# EAGLE design E-fliteMultiBatteryCharger (EAGLE 5.06)
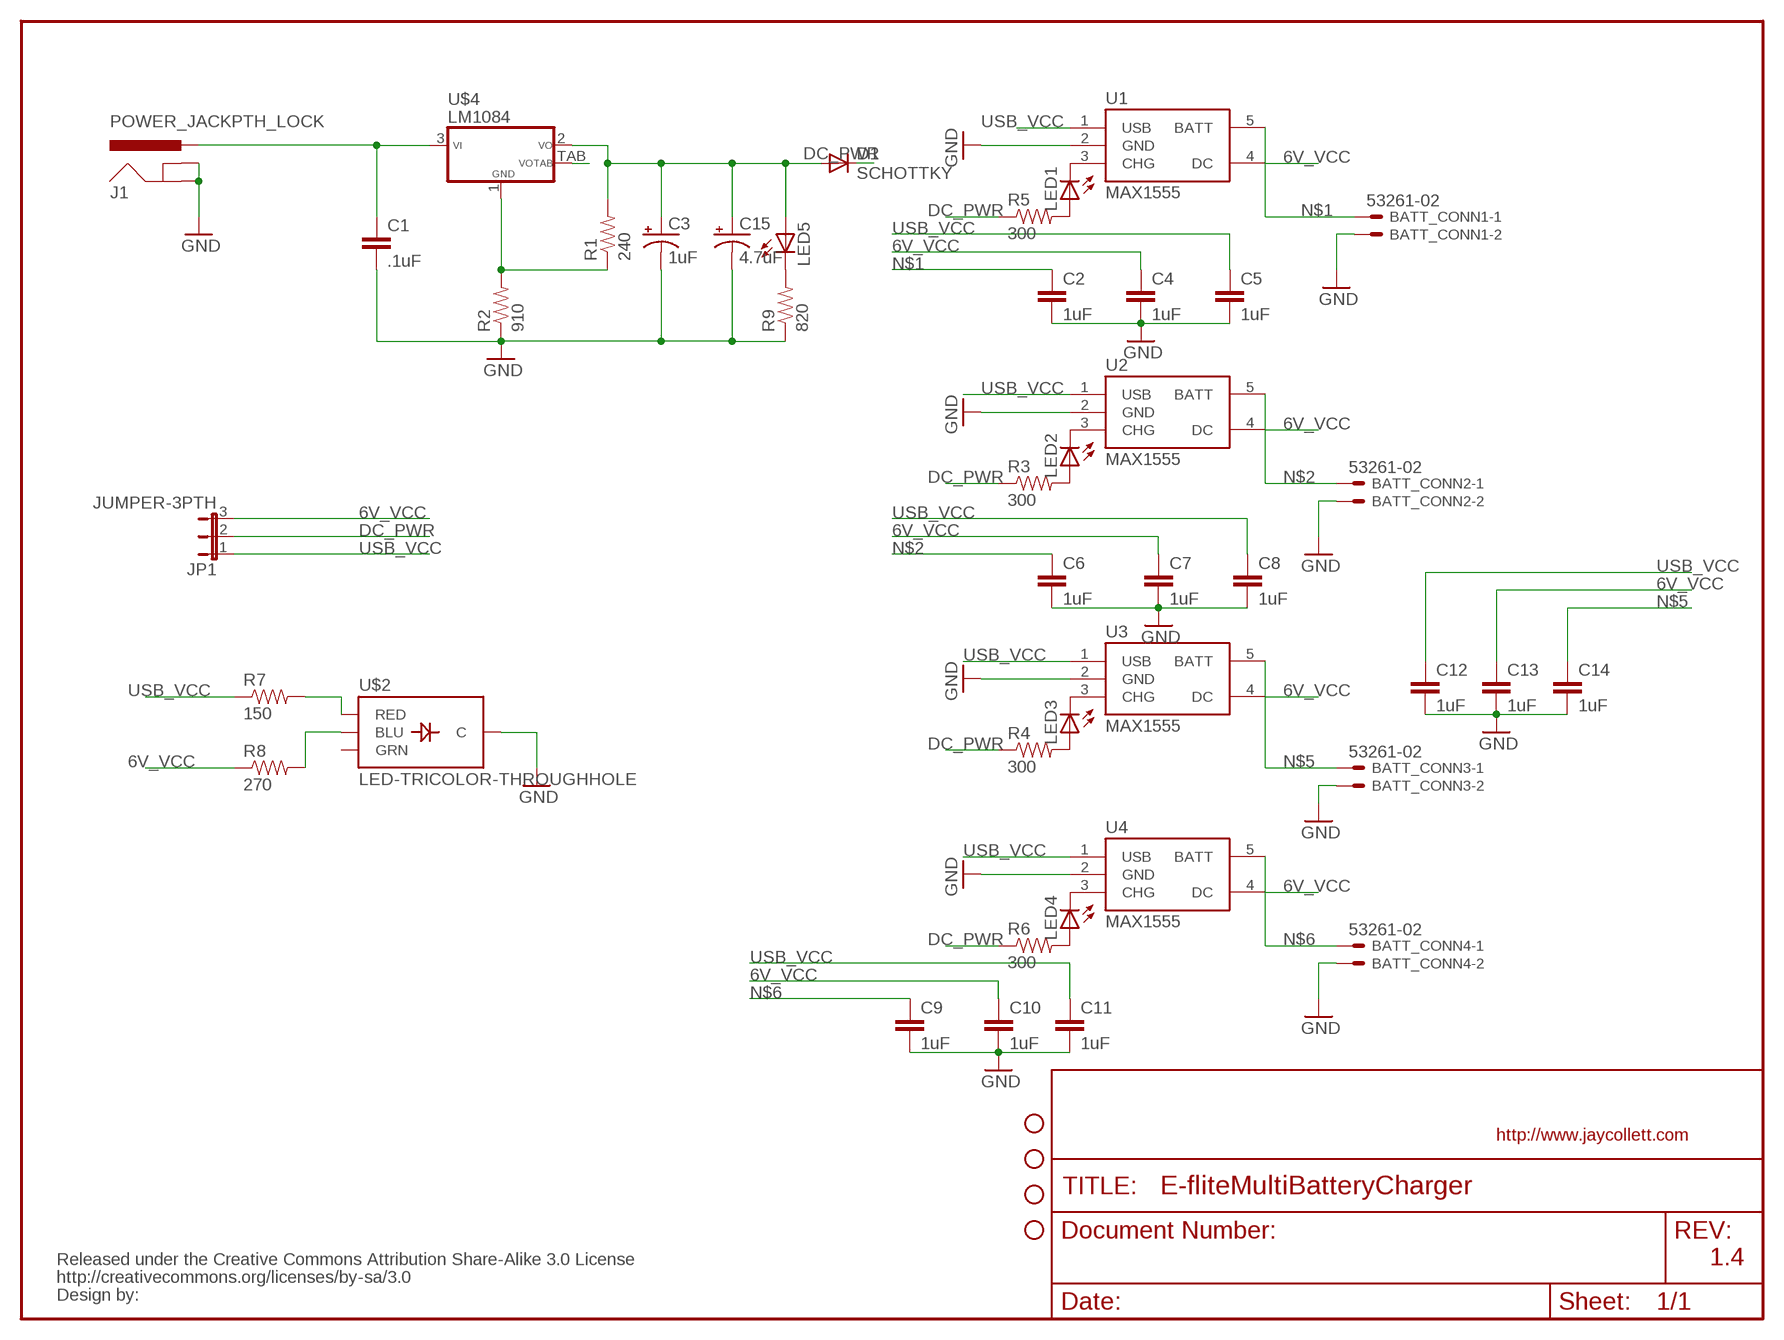
[diagram p0: schematic, sheet 1]

## Parts
BATT_CONN1  53261-02  [53261-02]
BATT_CONN2  53261-02  [53261-02]
BATT_CONN3  53261-02  [53261-02]
BATT_CONN4  53261-02  [53261-02]
C1  .1uF  CAP0603-CAP  [0603-CAP]
C2  1uF  CAP0603-CAP  [0603-CAP]
C3  1uF  CAP_POL1206  [EIA3216]
C4  1uF  CAP0603-CAP  [0603-CAP]
C5  1uF  CAP0603-CAP  [0603-CAP]
C6  1uF  CAP0603-CAP  [0603-CAP]
C7  1uF  CAP0603-CAP  [0603-CAP]
C8  1uF  CAP0603-CAP  [0603-CAP]
C9  1uF  CAP0603-CAP  [0603-CAP]
C10  1uF  CAP0603-CAP  [0603-CAP]
C11  1uF  CAP0603-CAP  [0603-CAP]
C12  1uF  CAP0603-CAP  [0603-CAP]
C13  1uF  CAP0603-CAP  [0603-CAP]
C14  1uF  CAP0603-CAP  [0603-CAP]
C15  4.7uF  CAP_POL1206  [EIA3216]
D1  SCHOTTKY  DIODESMA  [SMA-DIODE]
J1  POWER_JACKPTH_LOCK  [POWER_JACK_PTH_LOCK]
JP1  JUMPER-3PTH  [1X03]
JP2  STAND-OFF  [STAND-OFF]
JP3  STAND-OFF  [STAND-OFF]
JP4  STAND-OFF  [STAND-OFF]
JP5  STAND-OFF  [STAND-OFF]
LED1  LED3MM  [LED3MM]
LED2  LED3MM  [LED3MM]
LED3  LED3MM  [LED3MM]
LED4  LED3MM  [LED3MM]
LED5  LED0603  [LED-0603]
R1  240  RESISTOR1206  [1206]
R2  910  RESISTOR1206  [1206]
R3  300  RESISTOR  [0805]
R4  300  RESISTOR  [0805]
R5  300  RESISTOR  [0805]
R6  300  RESISTOR  [0805]
R7  150  RESISTOR  [0805]
R8  270  RESISTOR  [0805]
R9  820  RESISTOR  [0805]
U1  MAX1555  [SOT23-5]
U2  MAX1555  [SOT23-5]
U3  MAX1555  [SOT23-5]
U4  MAX1555  [SOT23-5]
U$1  CREATIVE_COMMONS  [CREATIVE_COMMONS]
U$2  LED-TRICOLOR-THROUGHHOLE  [LED-TRICOLOR-THROUGHHOLE]
U$4  LM1084  [TO263-3]

## Nets
6V_VCC: C4.1 C7.1 C10.1 C13.1 JP1.3 R8.1 U1.4(DC) U2.4(DC) U3.4(DC) U4.4(DC)
DC_PWR: D1.C JP1.2 R3.1 R4.1 R5.1 R6.1
GND: BATT_CONN1.2 BATT_CONN2.2 BATT_CONN3.2 BATT_CONN4.2 C1.2 C2.2 C3.C(-) C4.2 C5.2 C6.2 C7.2 C8.2 C9.2 C10.2 C11.2 C12.2 C13.2 C14.2 C15.C(-) J1.GND J1.GNDBREAK R2.1 R9.1 U1.2(GND) U2.2(GND) U3.2(GND) U4.2(GND) U$2.GND(C)
N$1: BATT_CONN1.1 C2.1 U1.5(BATT)
N$2: BATT_CONN2.1 C6.1 U2.5(BATT)
N$3: C1.1 J1.PWR U$4.3(VI)
N$4: R1.1 R2.2 U$4.1(GND)
N$5: BATT_CONN3.1 C14.1 U3.5(BATT)
N$6: BATT_CONN4.1 C9.1 U4.5(BATT)
N$8: LED1.K(C) U1.3(CHG)
N$9: LED1.A R5.2
N$10: LED2.K(C) U2.3(CHG)
N$11: LED2.A R3.2
N$12: LED3.K(C) U3.3(CHG)
N$13: LED3.A R4.2
N$14: LED4.K(C) U4.3(CHG)
N$15: LED4.A R6.2
N$16: R7.2 U$2.RED
N$17: R8.2 U$2.BLU
N$18: LED5.C R9.2
USB_VCC: C5.1 C8.1 C11.1 C12.1 JP1.1 R7.1 U1.1(USB) U2.1(USB) U3.1(USB) U4.1(USB)
VOTAB: C3.A(+) C15.A(+) D1.A LED5.A R1.2 U$4.2(VO) U$4.TAB(VOTAB)
Unconnected: U$2.GRN

## Notes on the sheet
- http://www.jaycollett.com
- 1.4

## Library data of the parts
BATT_CONN1-BATT_CONN4 = con-molex:53?-02: CONNECTOR wire to board 1.25 mm (.049 inch) pitch header
C1 C2 C4-C14 = SparkFun:CAP: Capacitor Standard 0603 ceramic capacitor, and 0.1" leaded capacitor.
C3 C15 = SparkFun:CAP_POL: Capacitor Polarized These are standard SMD and PTH capacitors. Normally 10uF, 47uF, and 100uF in electrolytic and tantalum varieties. Always verify the external diameter of the through hole cap, it varies with capacity, voltage, and manufacturer. The EIA devices should be standard.
D1 = SparkFun:DIODE: Diode These are standard reverse protection diodes and small signal diodes. SMA package can handle up to about 1A. SOD-323 can handle about 200mA. What the SOD-323 package when ordering, there are some mfgs out there that are 5-pin packages.
J1 = SparkFun:POWER_JACK: Power Jack This is the standard 5.5mm barrel jack for power. The PTH is the most common, proven, reliable, footprint. All others are experimental. The Slot footprint only works if the mill layer is transmitted to the PCB fab house so be warned. Spark Fun Electronics SKU : PRT-00119. Mating wall wart : TOL-00298 (and others)
JP1 = SparkFun:JUMPER-3
JP2-JP5 = SparkFun:STAND-OFF: Stand Off This is the mechanical footprint for a #4 phillips button head screw. Use the keepout ring to avoid running the screw head into surrounding components. SKU : PRT-00447
LED1-LED5 = SparkFun:LED: LEDs Standard schematic elements and footprints for 5mm, 3mm, 1206, and 0603 sized LEDs. 5mm - Spark Fun Electronics SKU : COM-00529 (and others)
R1-R9 = SparkFun:RESISTOR: Resistor Basic schematic elements and footprints for 0603, 1206, and PTH 1/10th watt (small) resistors.
U1-U4 = SparkFun:MAX1555: MAX1555 Lithium Charger IC SOT-23 Lithium Polymer charging IC. Schematic element and footprint proven. Spark Fun Electronics SKU : COM-00674
U$1 = SparkFun:CREATIVE_COMMONS
U$2 = SparkFun:LED-TRICOLOR-THROUGHHOLE
U$4 = JayCollett:LM1084: National LM1084 TO-263-3

## Board
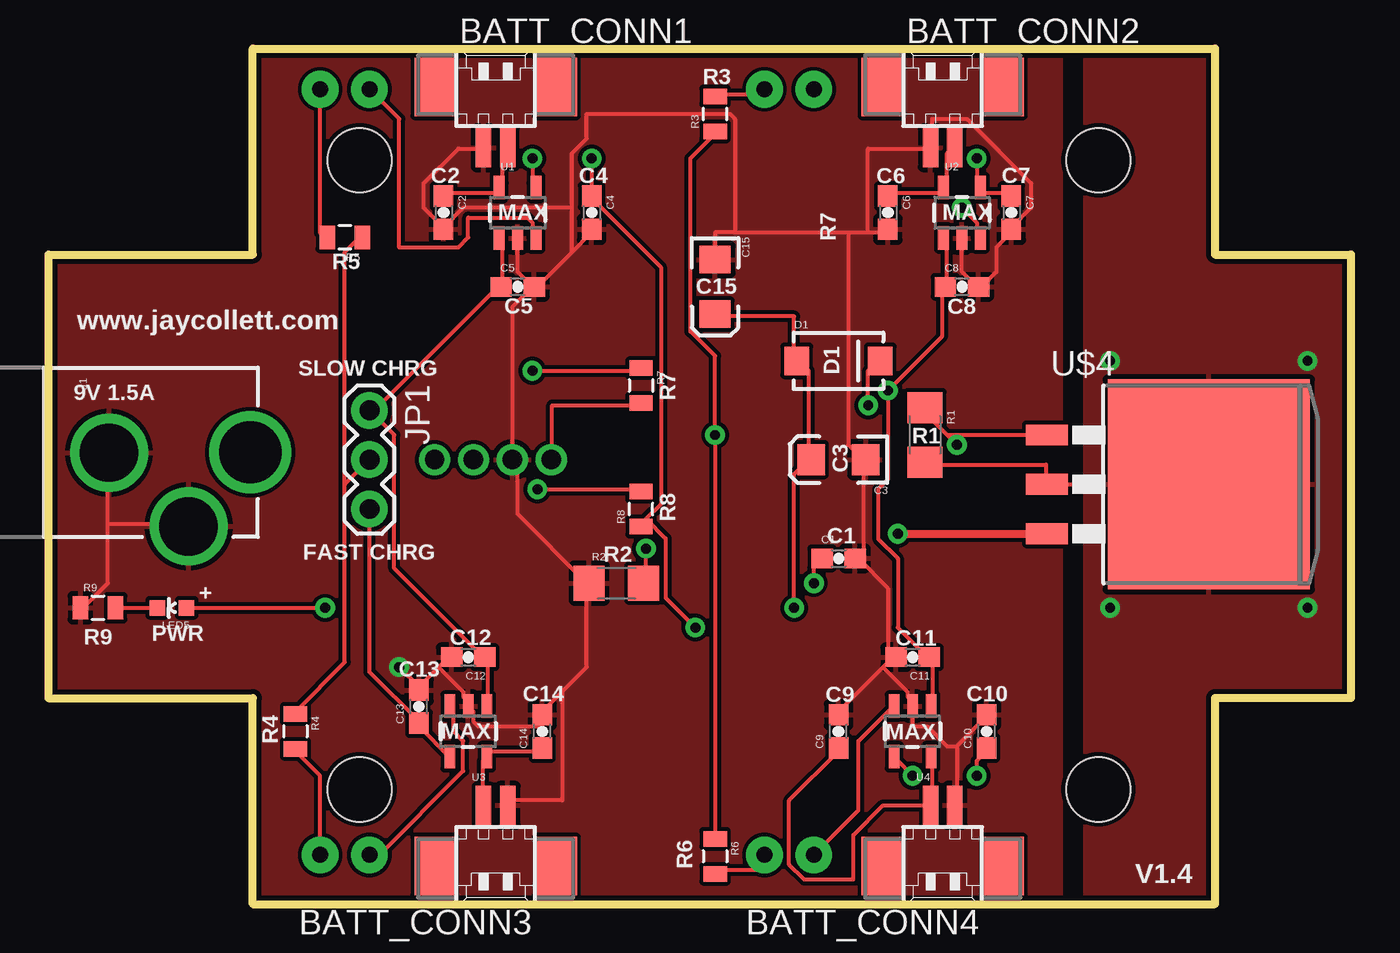
[diagram p1: board, top side]
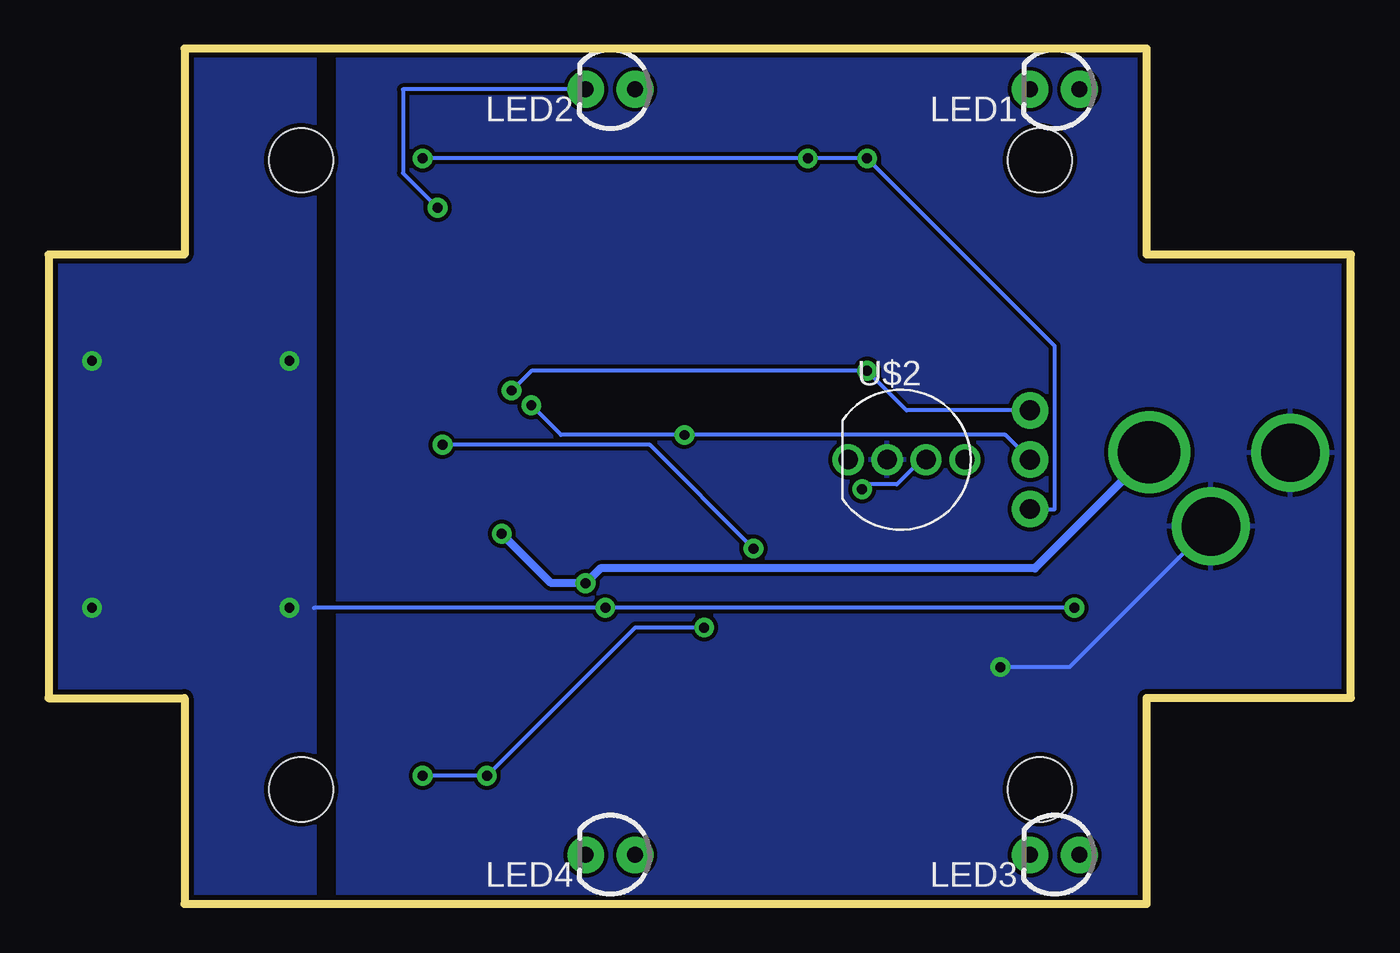
[diagram p2: board, bottom side, seen from below]

Size 67 x 44 mm. Coordinates in mm from the lower left corner, seen from the top.
Outline: 0,10.6 0,33.4 10.5,33.4 10.5,44 60,44 60,33.4 67,33.4 67,10.6 60,10.6 60,0 10.5,0 10.5,10.6 0,10.6
Copper layers (1*16): Top 0.035mm / dielectric 1.5mm / Bottom 0.035mm
Design rules "SparkFun": minimum track width 8mil, minimum drill 20mil, track to track 8mil, track to pad 8mil, pad to pad 8mil, via to via 8mil, smd to smd 8mil, copper to edge 10mil, drill to drill 8mil, minimum pad ring 12mil, minimum via ring 10mil, stop-mask expansion 4mil, vias tented up to drill 25mil, thermal gap 10mil

### Footprints (pad centres in the part's own frame; a part is rotated, then mirrored left to right if it is on the bottom)
53261-02 = smd 0.8 x 2: 1 0.625,-2.5; 2 -0.625,-2.5 | smd 2.1 x 3: S1 3.125,0.625; S2 -3.125,0.625
0603-CAP = smd 1.1 x 1: 1 -0.85,0; 2 0.85,0
EIA3216 = smd 1.4 x 1.6: A 1.4,0; C -1.4,0
SMA-DIODE = smd 1.27 x 1.47: A -2.15,0; C 2.15,0
POWER_JACK_PTH_LOCK = drill 2.997 round: GND 0.025,6.608; GNDBREAK 3.812,10.7 | drill 3.2 round: PWR 0,13.878
1X03 = drill 1.016 pad 1.88 round: 1 0,0; 2 2.54,0; 3 5.08,0
STAND-OFF = hole 3.302: 0,0
LED3MM = drill 0.813 pad 1.88 round: A -1.27,0; K 1.27,0
LED-0603 = smd 0.8 x 0.8: A 0,-0.75; C 0,0.75
1206 = smd 1.6 x 1.8: 1 -1.4,0; 2 1.4,0
0805 = smd 0.8 x 1.2: 1 -0.9,0; 2 0.9,0
SOT23-5 = smd 0.55 x 1.2: 1 -0.95,-1.3; 2 0,-1.3; 3 0.95,-1.3; 4 0.95,1.3; 5 -0.95,1.3
LED-TRICOLOR-THROUGHHOLE = drill 1 round: BLU 1,0; GND -1,0; GRN 3,0; RED -3,0
TO263-3 = smd 1.067 x 2.159: 1 -2.54,-5.791; 2 0,-5.791; 3 2.54,-5.791 | smd 10.8 x 10.41: TAB 0,2.54

### Placement (x,y rotation side)
BATT_CONN1  23,41.4 0 top
BATT_CONN2  46,41.4 0 top
BATT_CONN3  23,2.58 180 top
BATT_CONN4  46,2.58 180 top
C1  40.64,17.78 0 top
C2  20.32,35.56 270 top
C3  40.64,22.86 180 top
C4  27.94,35.56 270 top
C5  24.13,31.75 0 top
C6  43.18,35.56 270 top
C7  49.53,35.56 270 top
C8  46.99,31.75 0 top
C9  40.64,8.89 90 top
C10  48.26,8.89 90 top
C11  44.45,12.7 180 top
C12  21.59,12.7 180 top
C13  19.05,10.16 90 top
C14  25.4,8.89 90 top
C15  34.29,31.75 270 top
D1  40.64,27.94 0 top
J1  -3.5,23.24 270 top
JP1  16.51,25.4 270 top
JP2  16,38.25 0 top
JP3  16,5.9 0 top
JP4  54,5.9 0 top
JP5  54,38.25 0 top
LED1  15.24,41.91 180 bottom
LED2  38.1,41.91 180 bottom
LED3  15.24,2.54 180 bottom
LED4  38.1,2.54 180 bottom
LED5  6.35,15.24 90 top
R1  45.09,24.13 270 top
R2  29.21,16.51 0 top
R3  34.29,40.64 90 top
R4  12.7,8.89 270 top
R5  15.24,34.29 180 top
R6  34.29,2.46 270 top
R7  30.48,26.67 270 top
R8  30.48,20.32 90 top
R9  2.54,15.24 0 top
U1  24.13,35.56 0 top
U2  46.99,35.56 0 top
U3  21.59,8.89 180 top
U4  44.45,8.89 180 top
U$1  2.54,29.21 0 top
U$2  22.86,22.86 0 bottom
U$4  57.15,21.59 270 top

### Tracks (layer width: path | path; a pad name or v marks a point on that pad's centre or on a via)
6V_VCC  (via drill 0.51)
  Top 0.203: v47.75,6.6 47.75,7.37 48.26,7.87 C10.1 | v44.45,6.6 43.69,7.37 U4.4 | 30.73,19.81 30.48,19.56 R8.1 30.73,19.81 | 30.73,19.81 31.5,20.57 31.5,32.77 27.94,36.32 C4.1 v27.94,38.35 | v33.27,14.22 31.75,15.75 31.75,18.8 30.73,19.81 | U3.4 20.57,7.62 19.05,9.14 C13.1 19.05,9.4 16.51,11.94 JP1.3 | C7.1 49.53,36.58 48.01,36.58 48.01,36.83 U2.4 47.75,37.08 v47.75,38.35 | v24.89,38.35 24.89,37.08 U1.4
  Bottom 0.203: v47.75,6.6 v44.45,6.6 36.83,14.22 v33.27,14.22 | JP1.3 15.24,20.32 15.24,28.7 v24.89,38.35 v27.94,38.35 v47.75,38.35
DC_PWR  (via drill 0.51)
  Top 0.203: R6.1 v34.29,24.13 34.29,28.19 33.02,29.46 33.02,38.35 34.29,39.62 R3.1 | 15.24,21.59 15.24,12.45 12.7,9.91 R4.1 | 15.24,21.59 JP1.2 | 15.24,21.59 15.24,33.53 16,34.29 R5.1 | v42.16,25.65 42.16,27.43 42.67,27.94 D1.C
  Bottom 0.203: v42.16,25.65 40.64,24.13 v34.29,24.13 17.78,24.13 JP1.2
GND  (via drill 0.51)
  Top 0.203: U2.2 46.99,32.51 47.75,31.75 C8.2 48.01,31.75 48.77,32.51 48.77,33.78 49.53,34.54 C7.2 49.53,34.8 50.55,35.81 50.55,37.08 47.24,40.39 45.47,40.39 45.47,39.12 BATT_CONN2.2 45.21,38.86 42.16,38.86 42.16,34.54 | 35.31,34.54 34.29,34.54 C15.C | 35.31,34.54 41.15,34.54 | 41.15,34.54 42.16,34.54 | 42.16,34.54 43.18,34.54 C6.2 | 46.74,8.13 48.26,9.65 C10.2 | 46.74,8.13 46.74,5.33 BATT_CONN4.2 | 41.66,17.78 41.91,18.03 41.91,22.86 | 43.18,12.45 43.43,12.7 C11.2 43.18,12.45 | 43.18,12.45 42.93,12.19 | 42.93,12.19 40.64,9.91 C9.2 | 42.93,12.19 44.2,10.92 44.2,10.67 44.45,10.41 U4.2 44.45,9.14 45.21,9.14 46.23,8.13 46.74,8.13 | 41.66,17.78 43.18,16.26 43.18,12.45 | 41.66,17.78 C1.2 | 41.15,34.54 41.15,23.62 41.91,22.86 | 41.91,22.86 C3.C | 3.05,19.56 3.05,23.11 J1.GND | 3.05,19.56 3.05,16.51 1.78,15.24 R9.1 | 3.05,19.56 7.11,19.56 J1.GNDBREAK | 20.32,34.8 19.3,35.81 19.3,37.08 21.08,38.86 22.35,38.86 BATT_CONN1.2 | 24.89,31.75 24.13,32.51 U1.2 | 26.92,33.53 25.15,31.75 C5.2 24.89,31.75 | 26.92,33.53 27.94,34.54 C4.2 | 20.07,12.19 20.57,12.7 C12.2 | 19.05,11.18 20.07,12.19 | 20.07,12.19 21.34,10.92 21.34,10.67 21.59,10.41 U3.2 21.59,10.16 21.84,9.91 21.84,9.4 22.1,9.14 25.4,9.14 C14.2 25.4,9.91 26.42,10.92 | 26.42,10.92 27.69,12.19 27.69,16.51 | 26.42,10.92 26.42,5.33 23.88,5.33 BATT_CONN3.2 | 23.88,22.86 24.13,22.61 24.13,20.07 27.69,16.51 | 27.69,16.51 R2.1 | 24.89,31.75 23.88,30.73 23.88,22.86 | 23.88,22.86 U$2.GND | 20.32,34.8 21.34,35.81 26.92,35.81 | 26.92,33.53 26.92,35.81 | 20.32,34.8 C2.2 | v18.03,12.19 19.05,11.18 | 19.05,11.18 C13.2 | 35.31,34.54 35.31,40.39 35.05,40.64 27.69,40.64 27.69,39.37 26.92,38.61 26.92,35.81
  Bottom 0.203: v18.03,12.19 14.48,12.19 7.37,19.3 J1.GNDBREAK
  pour Top: 52.07,45.72 10.16,45.72 10.16,34.29 -1.27,34.29 -1.27,8.89 8.89,8.89 8.89,-1.27 52.07,-1.27
  pour Bottom: 52.07,45.72 10.16,45.72 10.16,34.29 -1.27,34.29 -1.27,8.89 8.89,8.89 8.89,-1.27 52.07,-1.27
N$1
  Top 0.203: C2.1 20.32,36.58 23.11,36.58 23.11,36.83 U1.5 23.37,37.08 23.37,38.61 23.62,38.86 BATT_CONN1.1
N$2
  Top 0.203: C6.1 43.18,36.58 45.97,36.58 45.97,36.83 U2.5 46.23,37.08 46.23,38.61 46.48,38.86 BATT_CONN2.1
N$3  (via drill 0.51)
  Top 0.203: v39.37,16.51 39.37,17.53 39.62,17.78 C1.1
  Top 0.406: v43.69,19.05 U$4.3
  Bottom 0.203: 10.41,23.11 J1.PWR
  Bottom 0.406: 10.41,23.11 16.26,17.27 38.61,17.27 v39.37,16.51 41.15,16.51 v43.69,19.05
N$4  (via drill 0.51)
  Top 0.203: v30.73,18.29 30.73,16.51 R2.2 | 46.23,24.13 45.21,25.15 45.21,25.4 R1.1 | v46.74,23.62 46.23,24.13 | 46.23,24.13 U$4.1
  Bottom 0.203: v30.73,18.29 36.07,23.62 v46.74,23.62
N$5
  Top 0.203: C14.1 25.4,7.87 22.61,7.87 22.61,7.62 U3.5 22.35,7.37 22.35,5.33 BATT_CONN3.1
N$6
  Top 0.203: C9.1 40.64,7.87 38.1,5.33 38.1,2.03 38.86,1.27 41.4,1.27 41.4,3.56 42.93,5.08 45.21,5.08 BATT_CONN4.1 45.47,5.33 45.47,7.37 U4.5
N$8
  Top 0.203: LED1.K 18.03,40.39 18.03,33.78 21.08,33.78 21.59,34.29 21.59,35.31 24.64,35.31 24.89,35.05 24.89,34.29 U1.3
N$9
  Top 0.203: LED1.A 13.97,34.54 14.22,34.29 R5.2
N$10  (via drill 0.51)
  Top 0.203: v46.99,35.81 47.75,35.05 47.75,34.29 U2.3
  Bottom 0.203: v46.99,35.81 48.77,37.59 48.77,41.91 LED2.K
N$11
  Top 0.203: LED2.A 36.83,41.66 34.29,41.66 R3.2
N$12
  Top 0.203: LED3.K 17.02,2.54 21.34,6.86 21.34,8.38 20.83,8.89 20.83,10.16 U3.3
N$13
  Top 0.203: LED3.A 13.97,6.6 12.7,7.87 R4.2
N$14
  Top 0.203: LED4.K 41.66,4.83 41.66,8.38 43.43,10.16 U4.3
N$15
  Top 0.203: LED4.A 36.83,1.78 34.29,1.78 R6.2
N$16
  Top 0.203: R7.2 30.48,25.65 25.91,25.65 25.91,22.86 U$2.RED
N$17  (via drill 0.51)
  Top 0.203: v25.15,21.34 30.48,21.34 R8.2
  Bottom 0.203: v25.15,21.34 24.89,21.59 23.37,21.59 22.1,22.86 U$2.BLU
N$18
  Top 0.203: R9.2 LED5.C
USB_VCC  (via drill 0.51)
  Top 0.203: U4.1 45.47,10.41 45.47,12.7 C11.1 45.21,12.7 43.69,14.22 43.69,17.78 42.67,18.8 42.67,21.34 43.18,21.84 v43.18,26.42 45.97,29.21 45.97,31.75 C8.1 46.23,31.75 46.23,34.04 U2.1 | U1.1 23.37,34.04 23.37,31.75 C5.1 23.11,31.75 16.76,25.4 16.76,25.15 | U3.1 22.61,10.41 22.61,12.7 C12.1 22.35,12.7 17.78,17.27 17.78,24.13 16.76,25.15 | v24.89,27.43 30.48,27.43 R7.1 | 16.76,25.15 JP1.1
  Bottom 0.203: JP1.1 22.86,25.4 v24.89,27.43 42.16,27.43 v43.18,26.42
VOTAB  (via drill 0.51)
  Top 0.203: 39.12,22.86 39.12,27.43 38.61,27.94 D1.A 38.35,27.94 38.35,30.23 34.29,30.23 C15.A | R1.2 45.21,22.61 51.31,22.61 51.31,21.59 U$4.2 53.34,21.59 | LED5.A v14.22,15.24 | 39.12,22.86 38.35,22.1 v38.35,15.24 | 39.12,22.86 C3.A
  Bottom 0.203: 53.34,15.24 v38.35,15.24 v14.22,15.24
  other vias: 54.61,15.24 54.61,27.94 64.77,27.94 64.77,15.24
  pour Top: 53.34,44.45 53.34,-1.27 60.96,-1.27 60.96,10.16 67.31,10.16 67.31,34.29 60.96,34.29 60.96,44.45
  pour Bottom: 53.34,44.45 53.34,-1.27 60.96,-1.27 60.96,10.16 67.31,10.16 67.31,34.29 60.96,34.29 60.96,44.45

### Text on the board
tPlace: R3 | C2 | C4 | C7 | C6 | MAX | MAX | R7 | R5 | www.jaycollett.com | C15 | C8 | C5 | D1 | SLOW CHRG | 9V 1.5A | R7 | C3 | R1 | R8 | FAST CHRG | C1 | R2 | + | PWR | C12 | C11 | R9 | C13 | C9 | C14 | C10 | MAX | MAX | R4 | R6 | V1.4